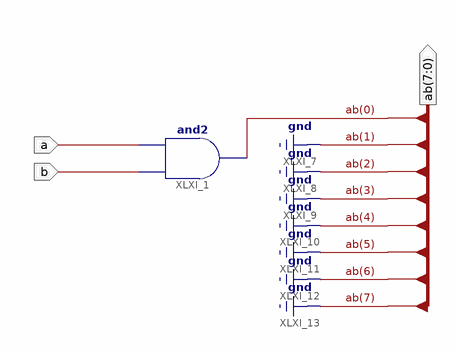
[diagram p0: schematic sheet 1]
// Xilinx ISE schematic extend_and_1to8bit.sch (spartan3e) as structural Verilog: 1 symbols, 3 ports
module extend_and_1to8bit (
  input  a,
  input  b,
  output [7:0] ab
);

  and XLXI_1 (ab[0], b, a);

  assign ab[7:1] = {7{1'b0}};
endmodule
